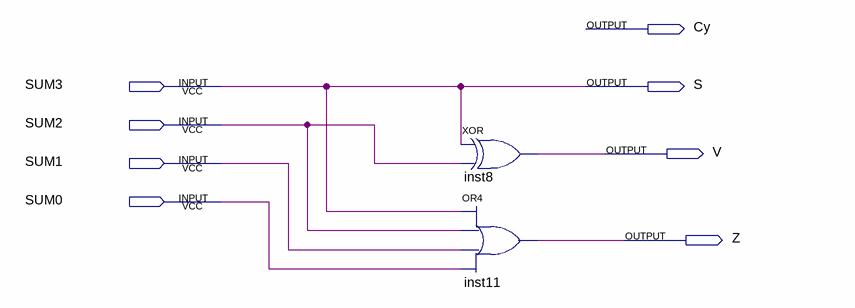
[diagram p0: schematic sheet]
// Quartus schematic Stateindicator.bdf as structural Verilog: 2 symbols, 8 pins
module Stateindicator (
  input  SUM3,
  input  SUM2,
  input  SUM1,
  input  SUM0,
  output Cy,
  output S,
  output V,
  output Z
);

  xor inst8 (V, SUM3, SUM2);
  or inst11 (Z, SUM3, SUM2, SUM1, SUM0);

  assign S = SUM3;
endmodule
